# Altium schematic sheet Sheet2.SchDoc
size A4
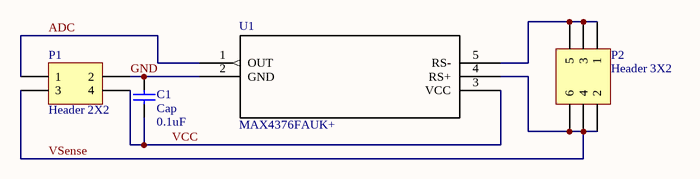
[diagram p0: Sheet2.SchDoc]

## Parts
C1  Cap  value 0.1uF  [C1206]
P1  Header 2X2  [HDR2X2]
P2  Header 3X2  [HDR2X3]
U1  MAX4376FAUK+  [21-0057F]

## Nets
ADC: P1.1 U1.1(OUT)
GND: C1.2 P1.2 U1.2(GND)
VCC: C1.1 P1.4 U1.3(VCC)
VSense: P1.3 P2.2 P2.4 P2.6 U1.4(RS+)
NetP2_1: P2.1 P2.3 P2.5 U1.5(RS-)

## Library data of the parts
C1 = Cap Semi: Capacitor (Semiconductor SIM Model); Published: 8-Jun-2000; LatestRevisionDate: 29-May-2009; LatestRevisionNote: IPC-7351 Footprint Added.; PackageReference: C1206; Publisher: Altium Limited; PackageDescription: Chip Capacitor
P1 = Header 2X2: Header, 2-Pin, Dual row; LatestRevisionDate: 17-Jul-2002; LatestRevisionNote: Re-released for DXP Platform.; Publisher: Altium Limited
P2 = Header 3X2: Header, 3-Pin, Dual row; LatestRevisionDate: 17-Jul-2002; LatestRevisionNote: Re-released for DXP Platform.; Publisher: Altium Limited
U1 = MAX4376FAUK+: Imported; Vendor: MAXIM; Manufacturer_Part_Number: max4376fauk+; RefDes: RefDes; Type: DEV; Value: Value